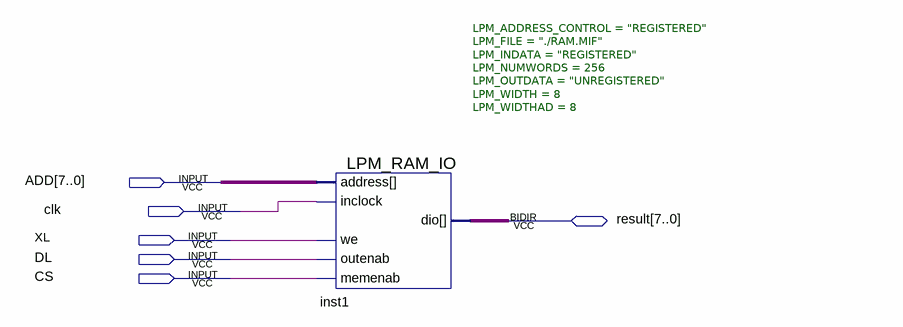
[diagram p0: schematic sheet]
// Quartus schematic RAM.bdf as structural Verilog: 1 symbols, 6 pins
module RAM (
  input  [7:0] ADD,
  input  clk,
  input  XL,
  input  DL,
  input  CS,
  inout  [7:0] result
);

  LPM_RAM_IO #(.LPM_ADDRESS_CONTROL("REGISTERED"), .LPM_FILE("./RAM.MIF"), .LPM_INDATA("REGISTERED"), .LPM_NUMWORDS(256), .LPM_OUTDATA("UNREGISTERED"), .LPM_WIDTH(8), .LPM_WIDTHAD(8)) inst1 (
    .address(ADD), .memenab(CS), .inclock(clk), .we(XL), .outenab(DL), .dio(result));
endmodule
